# EasyEDA schematic lijnvolger plan B.json
TITLE: Lijnvolger plan B; REV: 1.0; Date: 2023-10-05; Sheet: 1/1; Company: Hogent
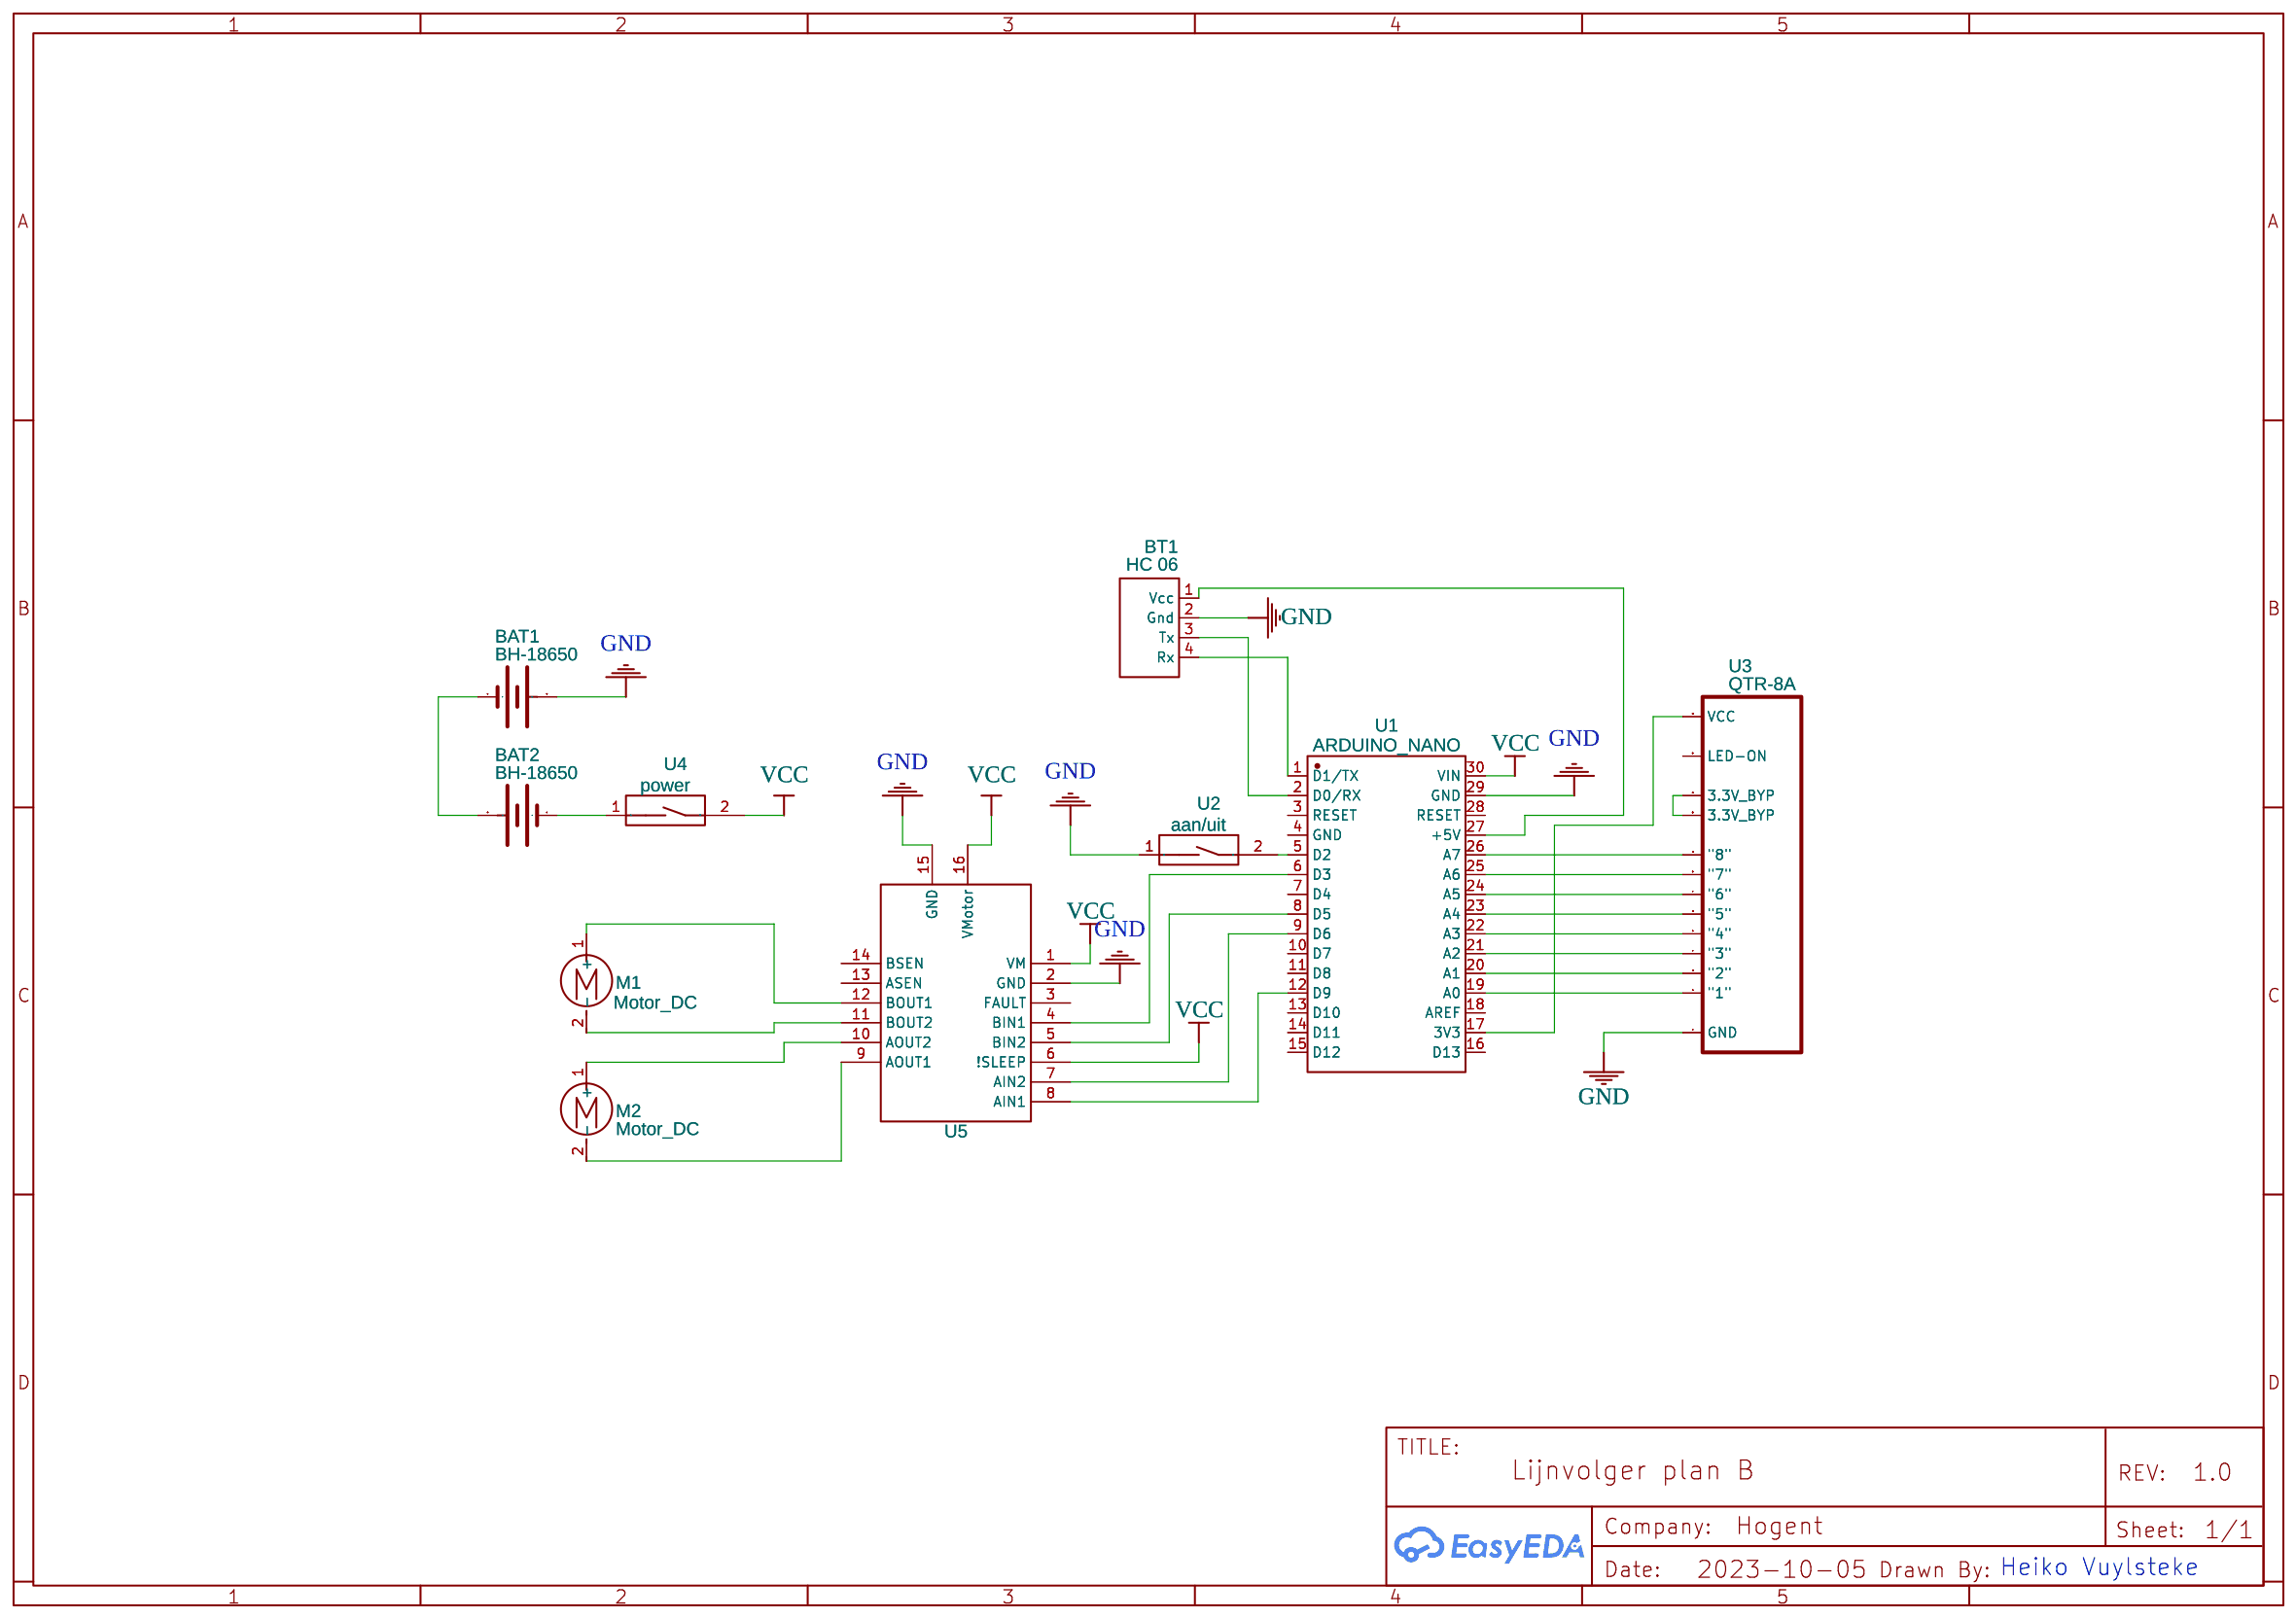
[diagram p0: schematic sheet]

## Parts
BAT1  BH-18650  [BAT-TH_BH-18650]
BAT2  BH-18650  [BAT-TH_BH-18650]
BT1  HC 06  [HDR-F-2.54_1X4]
M1  Motor_DC  [CONN-TH_2P-P5.08]
M2  Motor_DC  [CONN-TH_2P-P5.08]
U1  ARDUINO_NANO  [COMM-TH_ARDUINO_NANO]
U2  aan/uit  [DIP SWITCH 6 SWITCHES]
U3  QTR-8A  [QTR-8A/8RC]
U4  power  [DIP SWITCH 6 SWITCHES]
U5  -  [ADAFRUIT DRV8833]

## Library data of the parts
BAT1 BAT2 = BH-18650: Contributor: lcsc; Supplier: LCSC; Supplier Part: C9900017971; Manufacturer: null; JLCPCB Part Class: Extended Part; link: https://lcsc.com/eda_search?q=C9900017971&%26type=1&ref=editor
BT1 = HC 06: Contributor: RikiDev Company
M1 M2 = Motor_DC: Contributor: KiCAD; license: https://www.gnu.org/licenses/lgpl-2.1.html
U1 = ARDUINO_NANO: Contributor: lcsc; Supplier: LCSC; Supplier Part: C9900017879; Manufacturer: null; JLCPCB Part Class: Extended Part; link: https://lcsc.com/eda_search?q=C9900017879&%26type=1&ref=editor
U2 U4 = SWITCH: Manufacturer: DIP; Manufacturer Part: DIP switchEI-08; Supplier Part: C90019; Contributor: s6104031620126; libConvert: Yes; Add into BOM: Yes
U3 = QTR-8A: Manufacturer: Pololu; Supplier: Pololu; Supplier Part: 960; link: https://www.pololu.com/docs/pdf/0J12/QTR-8x.pdf; Contributor: Junikos
U5 = Adafruit DRV8833 Breakout: Manufacturer Part: Adafruit; link: https://www.adafruit.com/product/3297; Contributor: Dean OConnor

## Nets
GND: BAT1.2(+) BT1.2(Gnd) U1.29(GND) U2.1 U3.1(GND) U5.2(GND) U5.15(GND)
VCC: U1.30(VIN) U4.2 U5.1(VM) U5.6(!SLEEP) U5.16(VMotor)
Net-(BAT1-1): BAT1.1(-) BAT2.2(+)
Net-(BAT2-1): BAT2.1(-) U4.1
Net-(BT1-1): BT1.1(Vcc) U1.27(+5V)
Net-(BT1-3): BT1.3(Tx) U1.2(D0/RX)
Net-(BT1-4): BT1.4(Rx) U1.1(D1/TX)
Net-(M1-1): M1.1(+) U5.12(BOUT1)
Net-(M1-2): M1.2(-) U5.11(BOUT2)
Net-(M2-1): M2.1(+) U5.10(AOUT2)
Net-(M2-2): M2.2(-) U5.9(AOUT1)
Net-(U1-5): U1.5(D2) U2.2
Net-(U1-6): U1.6(D3) U5.4(BIN1)
Net-(U1-8): U1.8(D5) U5.5(BIN2)
Net-(U1-9): U1.9(D6) U5.7(AIN2)
Net-(U1-12): U1.12(D9) U5.8(AIN1)
Net-(U1-17): U1.17(3V3) U3.12(LED-ON)
Net-(U1-19): U1.19(A0) U3.2("1")
Net-(U1-20): U1.20(A1) U3.3("2")
Net-(U1-21): U1.21(A2) U3.4("3")
Net-(U1-22): U1.22(A3) U3.5("4")
Net-(U1-23): U1.23(A4) U3.6("5")
Net-(U1-24): U1.24(A5) U3.7("6")
Net-(U1-25): U1.25(A6) U3.8("7")
Net-(U1-26): U1.26(A7) U3.9("8")
Net-(U3-10): U3.10(3.3V BYP) U3.11(3.3V BYP)

Not connected (* = marked no-connect by the designer): U1 3(RESET) 4(GND) 7(D4) 10(D7) 11(D8) 13(D10) 14(D11) 15(D12) 16(D13) 18(AREF) 28(RESET); U5 3(FAULT) 13(ASEN) 14(BSEN)

## Notes on the sheet
- Heiko Vuylsteke
